# EAGLE design DimmerSaldatore (EAGLE 7.2.0)
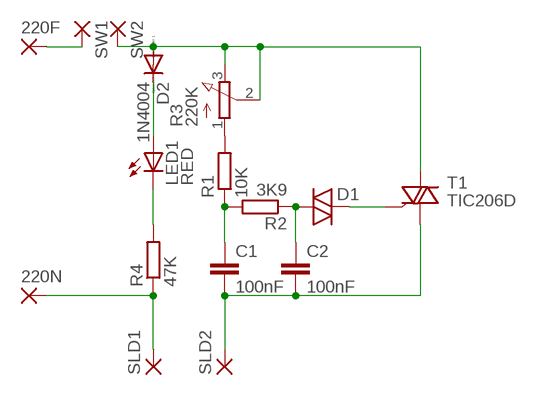
[diagram p0: schematic, sheet 1]

## Parts
220F  3,81/1,4  [3,81/1,4]
220N  3,81/1,4  [3,81/1,4]
C1  100nF  C-EU075-052X106  [C075-052X106]
C2  100nF  C-EU075-052X106  [C075-052X106]
D1  DIAC-GT32  [GT32]
D2  1N4004  [DO41-10]
LED1  RED  LED5MM  [LED5MM]
R1  10K  R-EU_0204/7  [0204/7]
R2  3K9  R-EU_0204/7  [0204/7]
R3  220K  3RP/1610N  [3RP/1610N]
R4  47K  R-EU_0204/7  [0204/7]
SLD1  3,81/1,4  [3,81/1,4]
SLD2  3,81/1,4  [3,81/1,4]
SW1  3,81/1,4  [3,81/1,4]
SW2  3,81/1,4  [3,81/1,4]
T1  TIC206D  [TO220BV]

## Nets
N$1: D1.2 T1.G
N$2: C2.1 D1.1 R2.1
N$3: C1.1 R1.1 R2.2
N$4: R1.2 R3.1(A)
N$5: D2.A R3.2(S) R3.3(E) SW2.1(P) T1.T2(A2)
N$7: 220N.1(P) R4.1 SLD1.1(P)
N$8: D2.C LED1.A
N$9: LED1.K(C) R4.2
N$10: 220F.1(P) SW1.1(P)
N$13: C1.2 C2.2 SLD2.1(P) T1.T1(A1)

## Library data of the parts
220F 220N SLD1 SLD2 SW1 SW2 = wirepad:3,81/1,4: THROUGH-HOLE PAD
C1 C2 = resistor:C-EU: CAPACITOR, European symbol
D1 = diode:DIAC-: DIAC
D2 = diode:1N4004: DIODE general purpose rectifier, 1 A
LED1 = led:LED: LED OSRAM: - CHIPLED LG R971, LG N971, LY N971, LG Q971, LY Q971, LO R971, LY R971 LH N974, LH R974 LS Q976, LO Q976, LY Q976 LO Q996 - Hyper CHIPLED LW Q18S LB Q993, LB Q99A, LB R99A - SideLED LS A670, LO A670, LY A670, LG A670, LP A670 LB A673, LV A673, LT A673, LW A673 LH A674 LY A675 LS A676, LA A676, LO A676, LY A676, LW A676 LS A679, LY A679, LG A679 - Hyper Micro SIDELED® LS Y876, LA Y876, LO Y876, LY Y876 LT Y87S - SmartLED LW L88C, LW L88S LB L89C, LB L89S, LG L890 LS L89K, LO L89K, LY L89K LS L896, LA L896, LO L896, LY L896 - TOPLED LS T670, LO T670, LY T670, LG T670, LP T670 LSG T670, LSP T670, LSY T670, LOP T670, LYG T670 LG T671, LOG T671, LSG T671 LB T673, LV T673, LT T673, LW T673 LH T674 LS T676, LA T676, LO T676, LY T676, LB T676, LH T676, LSB T676, LW T676 LB T67C, LV T67C, LT T67C, LS T67K, LO T67K, LY T67K, LW E67C LS E67B, LA E67B, LO E67B, LY E67B, LB E67C, LV E67C, LT E67C LW T67C LS T679, LY T679, LG T679 LS T770, LO T770, LY T770, LG T770, LP T770 LB T773, LV T773, LT T773, LW T773 LH T774 LS E675, LA E675, LY E675, LS T675 LS T776, LA T776, LO T776, LY T776, LB T776 LHGB T686 LT T68C, LB T68C - Hyper Mini TOPLED® LB M676 - Mini TOPLED Santana® LG M470 LS M47K, LO M47K, LY M47K Source: http://www.osram.convergy.de LUXEON: - LUMILED® LXK2-PW12-R00, LXK2-PW12-S00, LXK2-PW14-U00, LXK2-PW14-V00 LXK2-PM12-R00, LXK2-PM12-S00, LXK2-PM14-U00 LXK2-PE12-Q00, LXK2-PE12-R00, LXK2-PE12-S00, LXK2-PE14-T00, LXK2-PE14-U00 LXK2-PB12-K00, LXK2-PB12-L00, LXK2-PB12-M00, LXK2-PB14-N00, LXK2-PB14-P00, LXK2-PB14-Q00 LXK2-PR12-L00, LXK2-PR12-M00, LXK2-PR14-Q00, LXK2-PR14-R00 LXK2-PD12-Q00, LXK2-PD12-R00, LXK2-PD12-S00 LXK2-PH12-R00, LXK2-PH12-S00 LXK2-PL12-P00, LXK2-PL12-Q00, LXK2-PL12-R00 Source: www.luxeon.com KINGBRIGHT: KA-3528ASYC Source: www.kingbright.com
R1 R2 R4 = resistor:R-EU_: RESISTOR, European symbol
R3 = pot:3RP/1610N: 16mm Potentiometer one level Source: http://www.alphapotentiometers.net/html/16mm_pot_2.html
T1 = triac:TIC206: TRIAC Source: http://www.bourns.com/pdfs/tic206.pdf

## Board
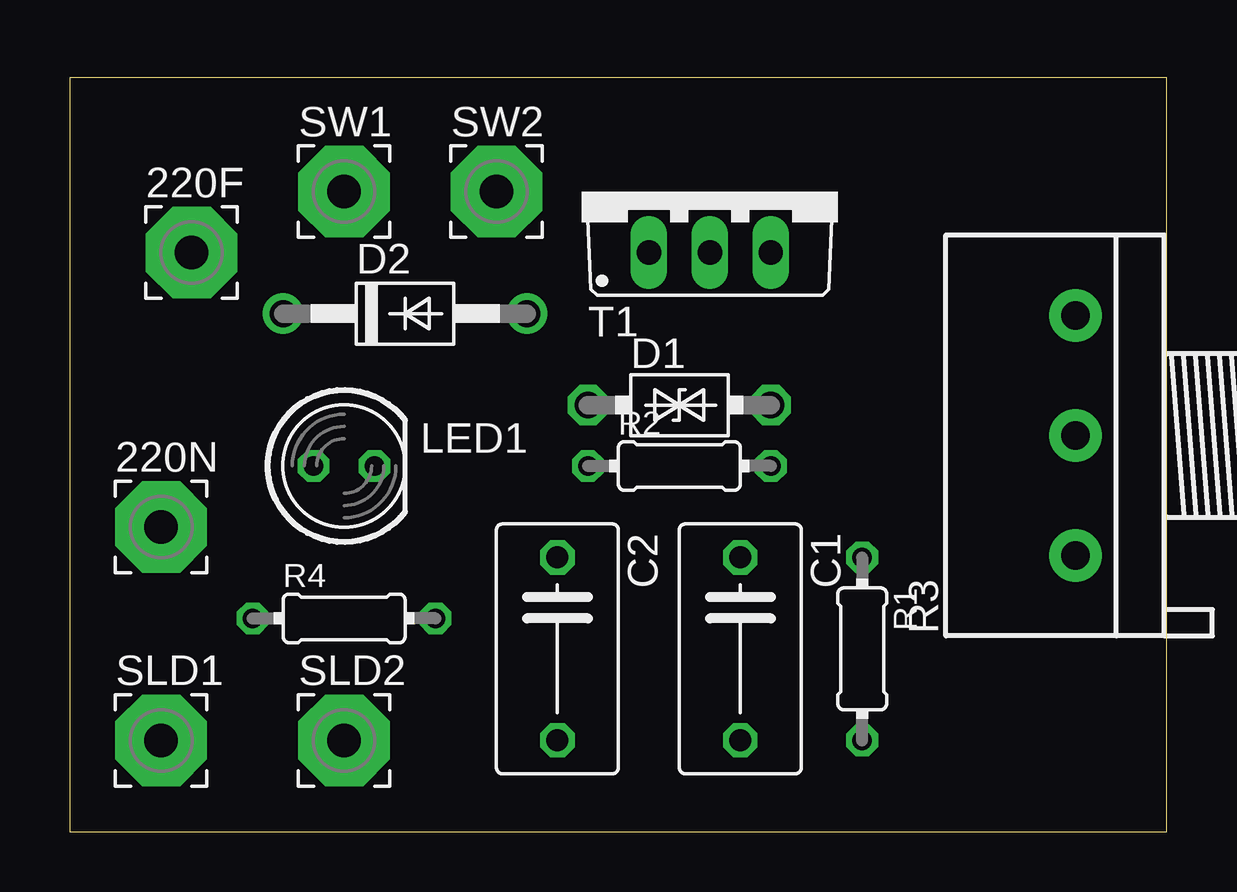
[diagram p1: board, top side]
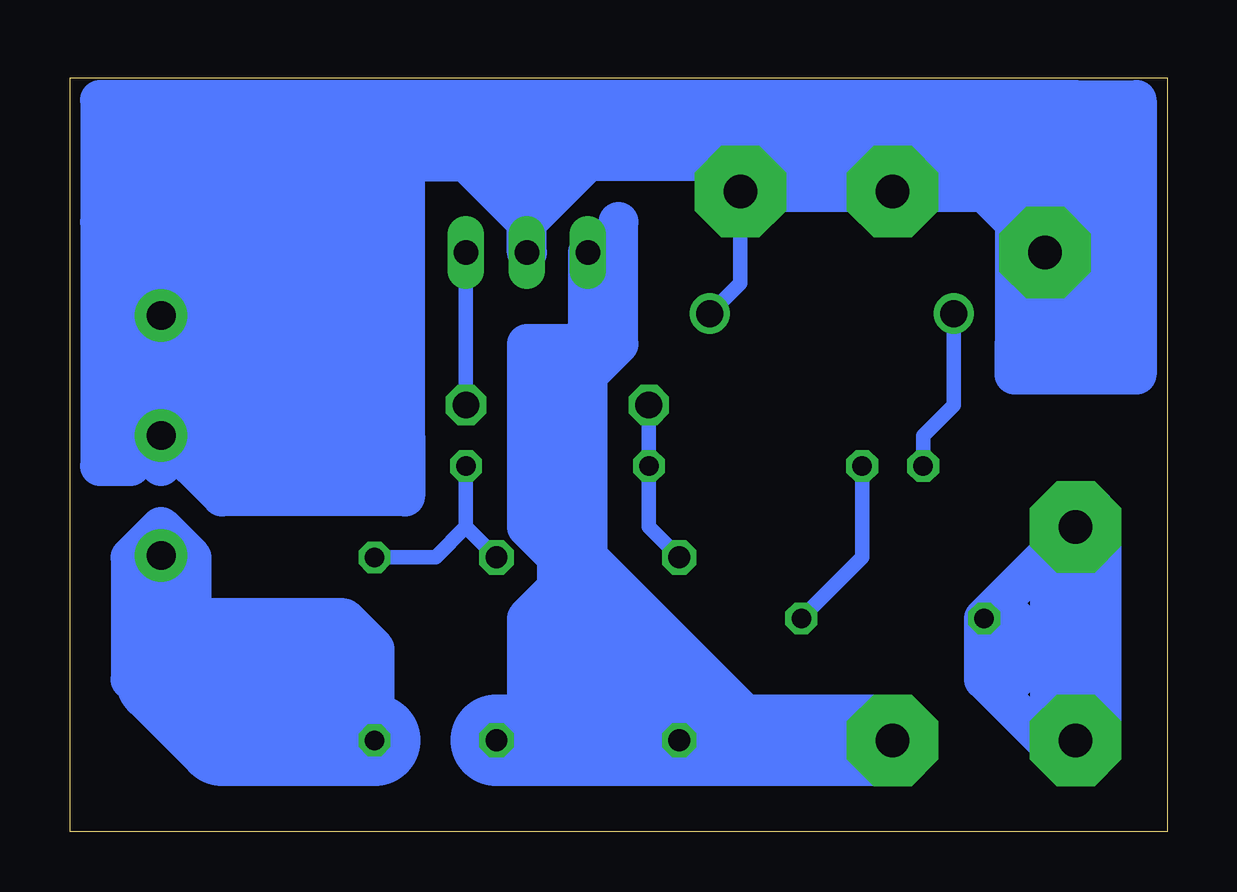
[diagram p2: board, bottom side, seen from below]

Size 45.7 x 31.42 mm. Coordinates in mm from the lower left corner, seen from the top.
Outline: 0,0 45.7,0 45.7,31.42 0,31.42 0,0
Copper layers (1*16): Top 0.035mm / dielectric 1.5mm / Bottom 0.035mm
Design rules "default": minimum track width 10mil, minimum drill 24mil, track to track 8mil, track to pad 8mil, pad to pad 8mil, via to via 8mil, smd to smd 8mil, copper to edge 40mil, drill to drill 8mil, minimum pad ring 10mil, minimum via ring 8mil, stop-mask expansion 4mil, vias tented up to drill 0mil, thermal gap 10mil

### Footprints (pad centres in the part's own frame; a part is rotated, then mirrored left to right if it is on the bottom)
3,81/1,4 = drill 1.397 pad 3.81 octagon: 1 0,0
C075-052X106 = drill 0.914 octagon: 1 -3.81,0; 2 3.81,0
GT32 = drill 1.118 octagon: 1 -3.81,0; 2 3.81,0
DO41-10 = drill 1.118: A 5.08,0; C -5.08,0
LED5MM = drill 0.813 octagon: A -1.27,0; K 1.27,0
0204/7 = drill 0.813 octagon: 1 -3.81,0; 2 3.81,0
3RP/1610N = drill 1.2 pad 2.184: 1 -5,0; 2 0,0; 3 5,0
TO220BV = drill 1.016 long: G 2.54,-2.54; T1 -2.54,-2.54; T2 0,-2.54

### Placement (x,y rotation side)
220F  5.08,24.13 0 top
220N  3.81,12.7 0 top
C1  27.94,7.62 270 top
C2  20.32,7.62 270 top
D1  25.4,17.78 0 top
D2  13.97,21.59 0 top
LED1  11.43,15.24 0 top
R1  33.02,7.62 270 top
R2  25.4,15.24 0 top
R3  41.91,16.51 90 top
R4  11.43,8.89 0 top
SLD1  3.81,3.81 0 top
SLD2  11.43,3.81 0 top
SW1  11.43,26.67 0 top
SW2  17.78,26.67 0 top
T1  26.67,26.67 0 top

### Tracks (layer width: path | path; a pad name or v marks a point on that pad's centre or on a via)
N$1
  Bottom 0.61: T1.G D1.2
N$2
  Bottom 0.61: C2.1 21.59,12.7 R2.1 D1.1
N$3
  Bottom 0.61: R2.2 29.21,12.7 | 29.21,12.7 C1.1 | 29.21,12.7 30.48,11.43 R1.1
N$4
  Bottom 1.676: 41.91,6.35 R3.1
  Bottom 3.81: R1.2 39.37,3.81 41.91,6.35
N$5
  Bottom 0.406: SW2.1 17.78,25.4
  Bottom 0.61: R3.2 R3.3 41.91,25.4 | 17.78,25.4 17.78,22.86 D2.A
  Bottom 1.676: R3.2 41.91,25.4 40.64,26.67 | 40.64,26.67 39.37,27.94 31.75,27.94 | 31.75,27.94 29.21,27.94 | 29.21,27.94 26.67,27.94 | 26.67,27.94 26.67,29.21 | 26.67,29.21 17.78,29.21 17.78,27.94 | SW2.1 17.78,27.94 | 17.78,27.94 24.13,27.94 | 26.67,29.21 39.37,29.21 43.18,25.4 43.18,16.51 41.91,15.24 40.64,16.51 | 40.64,16.51 40.64,24.13 | 40.64,25.4 40.64,26.67 | 26.67,25.4 26.67,27.94 | 26.67,27.94 24.13,27.94 | 24.13,27.94 26.67,25.4 | T1.T2 26.67,25.4 | 26.67,25.4 29.21,27.94 | 33.02,26.67 39.37,26.67 40.64,25.4 | 40.64,25.4 40.64,24.13 | 40.64,24.13 33.02,24.13 33.02,25.4 39.37,25.4 39.37,17.78 38.1,16.51 | 38.1,16.51 31.75,16.51 | 31.75,16.51 31.75,27.94 | 31.75,27.94 33.02,26.67 | 33.02,26.67 33.02,17.78 38.1,17.78 38.1,22.86 34.29,22.86 34.29,19.05 36.83,19.05 36.83,21.59 35.56,21.59 35.56,20.32 | 40.64,16.51 39.37,16.51 | 39.37,16.51 38.1,16.51 | 31.75,16.51 31.75,13.97 39.37,13.97 | 39.37,13.97 39.37,15.24 | 39.37,15.24 39.37,16.51 | 39.37,16.51 38.1,15.24 | 38.1,15.24 33.02,15.24 | 38.1,15.24 39.37,15.24 | 39.37,15.24 40.64,15.24 39.37,13.97
N$7
  Bottom 1.676: R4.1 220N.1 | SLD1.1 5.08,3.81 7.62,6.35 R4.1 | R4.1 6.35,8.89 6.35,6.35
  Bottom 3.81: 220N.1 SLD1.1
N$8
  Bottom 0.61: D2.C 8.89,17.78 10.16,16.51 LED1.A
N$9
  Bottom 0.61: LED1.K 12.7,11.43 R4.2
N$10
  Bottom 0.61: 220F.1 5.08,25.4 6.35,26.67
  Bottom 1.676: 5.08,26.67 6.35,27.94 | 6.35,27.94 11.43,27.94 SW1.1 7.62,26.67 | 7.62,26.67 6.35,26.67 | 6.35,26.67 5.08,26.67 | 5.08,26.67 220F.1 7.62,26.67 | 7.62,26.67 6.35,27.94 | 6.35,27.94 3.81,27.94 | 3.81,27.94 3.81,24.13 | 3.81,27.94 3.81,30.48 | 3.81,30.48 39.37,30.48 | 39.37,30.48 43.18,26.67 | 39.37,30.48 44.45,30.48 44.45,25.4 | 44.45,25.4 43.18,26.67 | 43.18,26.67 43.18,29.21 41.91,29.21 | 3.81,30.48 1.27,30.48 1.27,19.05 6.35,19.05 6.35,20.32 | 6.35,26.67 6.35,20.32 | 6.35,20.32 2.54,20.32 2.54,21.59 | 2.54,29.21 2.54,21.59 | 2.54,21.59 5.08,21.59 3.81,22.86 | 44.45,25.4 44.45,15.24 43.18,15.24
N$12
  Bottom 1.676: 5.08,29.21 16.51,29.21 16.51,27.94 | 16.51,27.94 16.51,26.67 12.7,26.67 13.97,27.94 | 13.97,27.94 16.51,27.94 | 13.97,27.94 12.7,27.94
N$13
  Bottom 0.61: T1.T1 24.13,21.59 25.4,20.32 25.4,19.05 | 25.4,10.16 25.4,3.81 C1.2
  Bottom 1.676: 22.86,25.4 22.86,20.32 24.13,19.05 | T1.T1 24.13,20.32 | 24.13,20.32 25.4,19.05 25.4,12.7 25.4,11.43 | 24.13,5.08 24.13,6.35 | 24.13,6.35 24.13,11.43 | 24.13,11.43 24.13,19.05 | 24.13,19.05 24.13,20.32 | 24.13,20.32 26.67,20.32 26.67,12.7 25.4,11.43 | 25.4,11.43 25.4,10.16 26.67,8.89 26.67,5.08 25.4,6.35 24.13,6.35 | 24.13,6.35 19.05,6.35 | 19.05,6.35 17.78,5.08 | 19.05,6.35 22.86,10.16 | 24.13,11.43 22.86,10.16 | 22.86,10.16 22.86,7.62 21.59,7.62 | 24.13,6.35 25.4,7.62 25.4,11.43
  Bottom 3.81: C1.2 C2.2 SLD2.1
N$14
  Bottom 1.676: 33.02,5.08 33.02,7.62 34.29,8.89 40.64,8.89 | 40.64,6.35 40.64,8.89 | 40.64,8.89 40.64,11.43 41.91,12.7 43.18,11.43 43.18,6.35 | 40.64,8.89 39.37,7.62 39.37,6.35 34.29,6.35 34.29,7.62 38.1,7.62